# Altium schematic sheet FPGA_Bank_0_Supplies.SchDoc
size 420 x 297 mm; EDA_Number: ARTIQ; CompanyName: WUT ISE; Organization: WUT ISE; DocumentNumber: 12; SheetNumber: 7; ModifiedBy: -; Title2: FPGA power&caps + bank 0; ModifiedDate: -
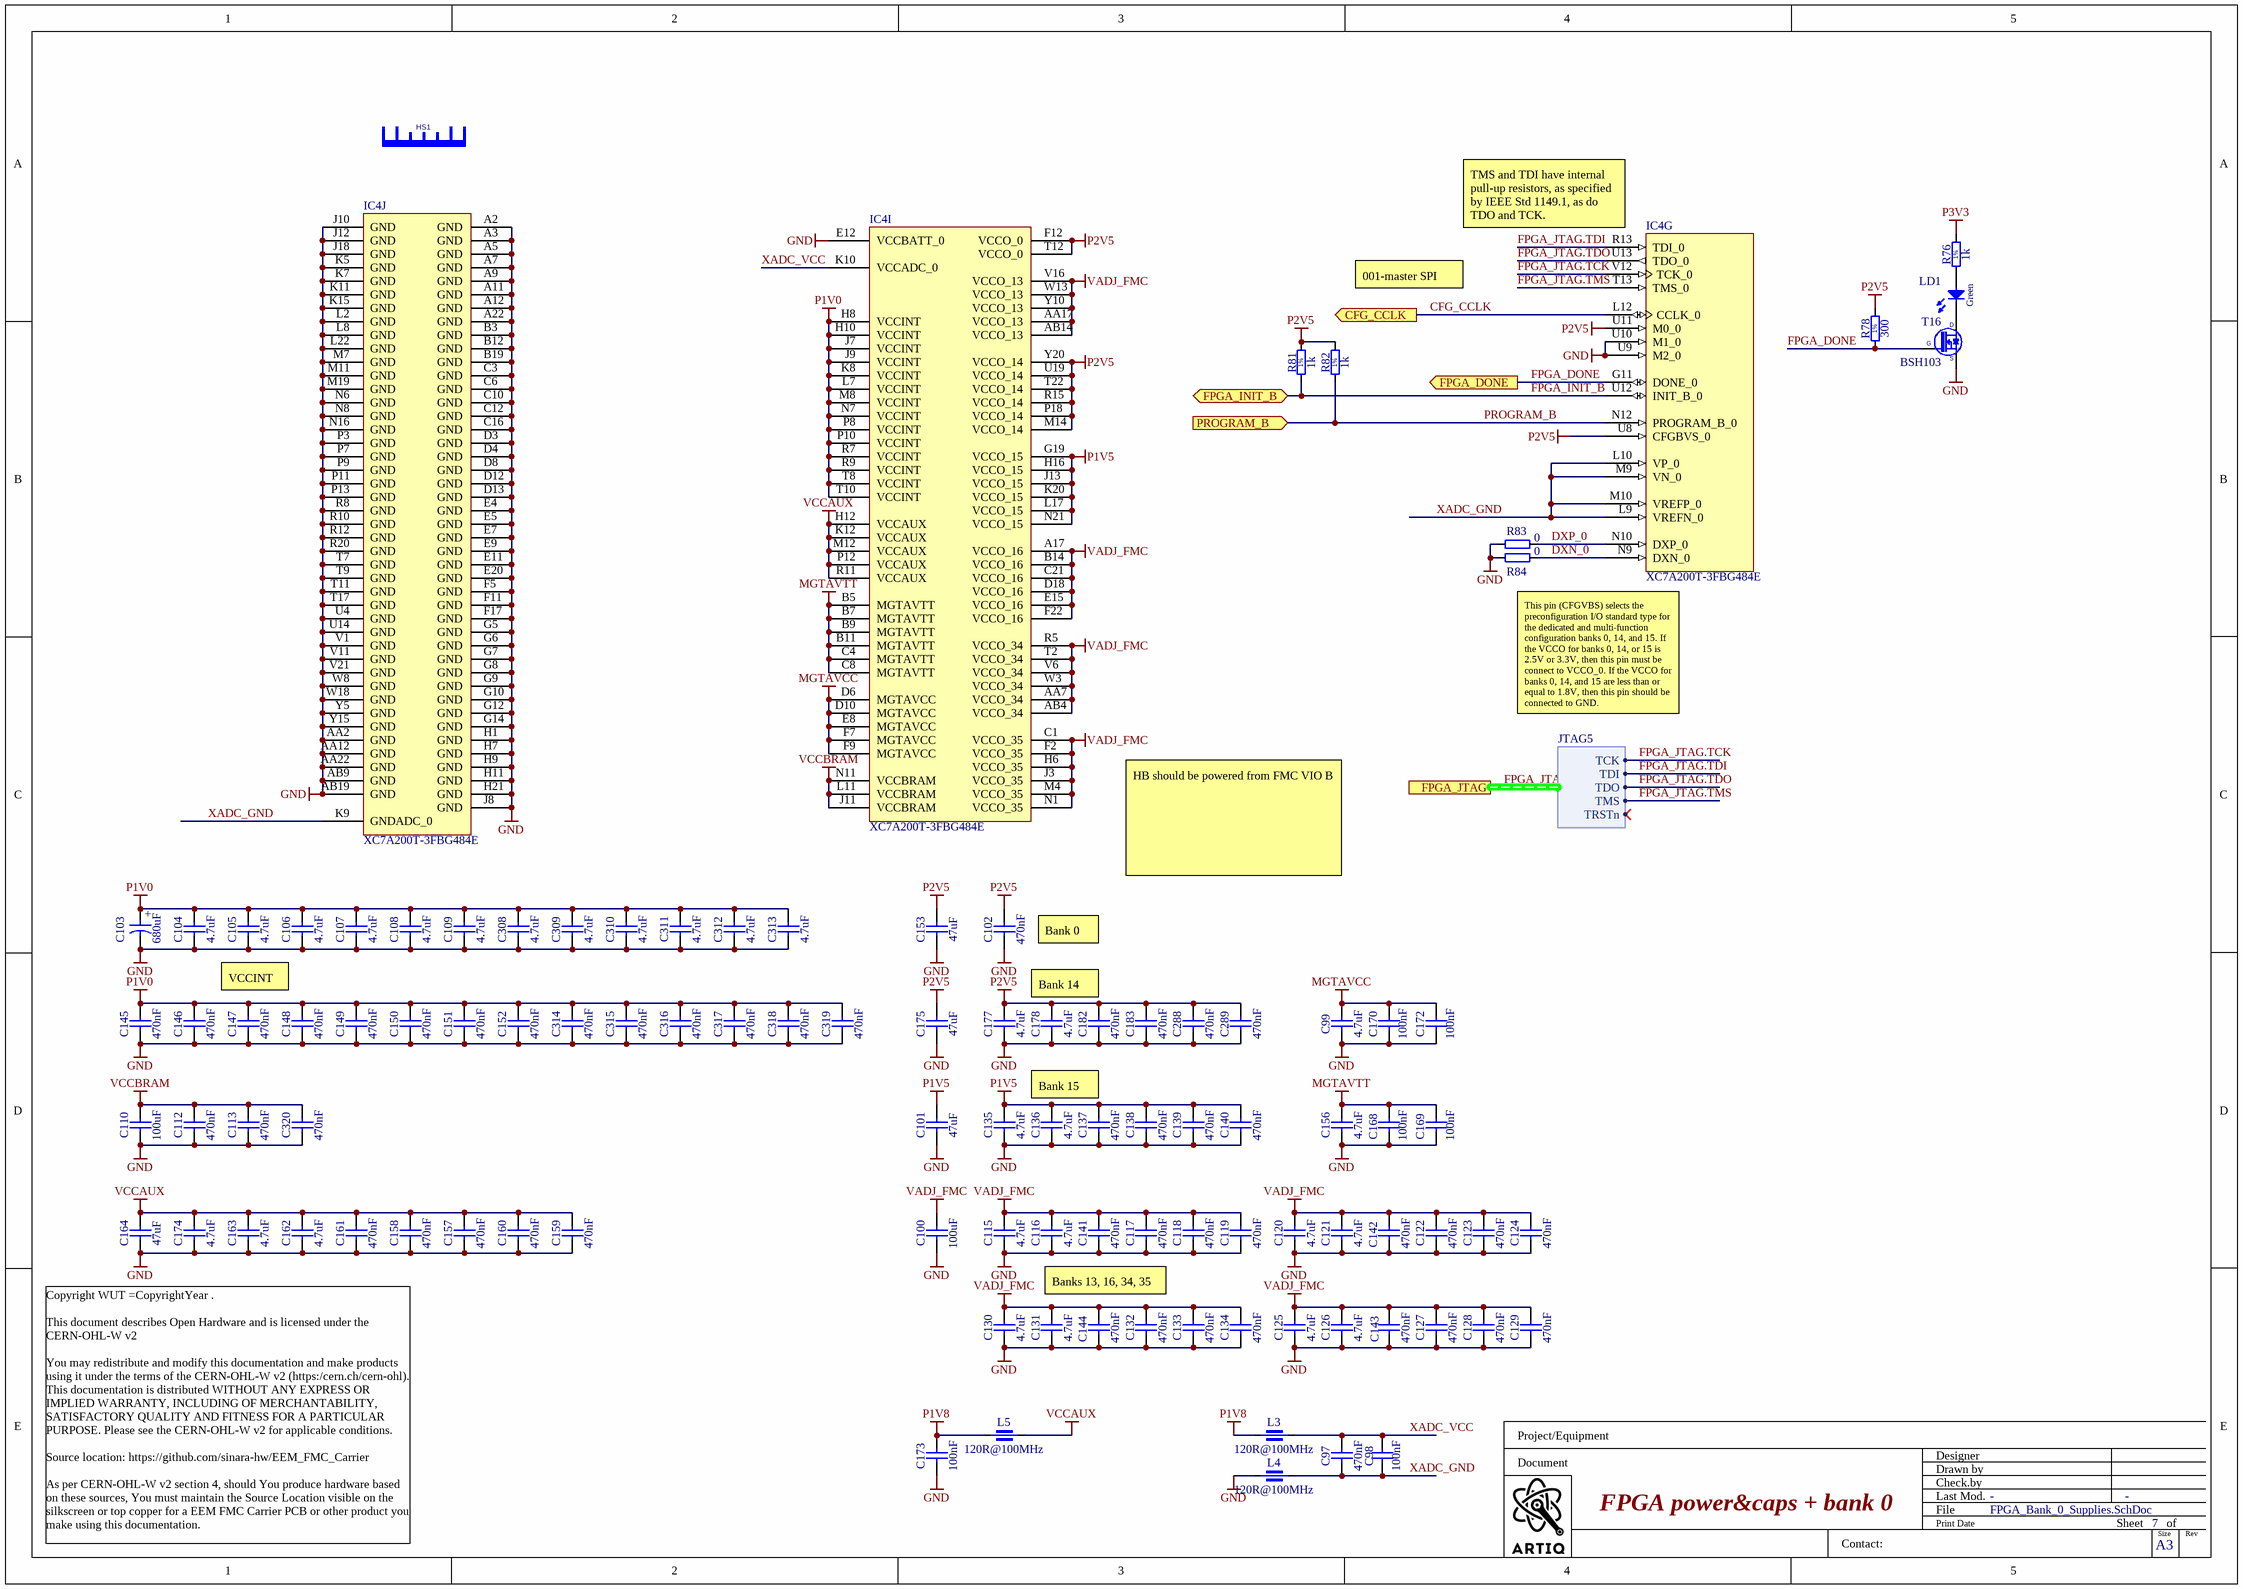
[diagram p0: FPGA_Bank_0_Supplies.SchDoc]

## Parts
C97  470nF  [CAPC0603X33N]
C98  100nF  [CAPC0603X33N]
C99  4.7uF  [CAPC1005X55N]
C100  100uF  [CAPC3216X180N]
C101  47uF  [CAPC1608X100N]
C102  470nF  [CAPC0603X33N]
C103  680uF  [CAPMP7343X430N]
C104  4.7uF  [CAPC1005X55N]
C105  4.7uF  [CAPC1005X55N]
C106  4.7uF  [CAPC1005X55N]
C107  4.7uF  [CAPC1005X55N]
C108  4.7uF  [CAPC1005X55N]
C109  4.7uF  [CAPC1005X55N]
C110  100uF  [CAPC3216X180N]
C112  470nF  [CAPC0603X33N]
C113  470nF  [CAPC0603X33N]
C115  4.7uF  [CAPC1005X55N]
C116  4.7uF  [CAPC1005X55N]
C117  470nF  [CAPC0603X33N]
C118  470nF  [CAPC0603X33N]
C119  470nF  [CAPC0603X33N]
C120  4.7uF  [CAPC1005X55N]
C121  4.7uF  [CAPC1005X55N]
C122  470nF  [CAPC0603X33N]
C123  470nF  [CAPC0603X33N]
C124  470nF  [CAPC0603X33N]
C125  4.7uF  [CAPC1005X55N]
C126  4.7uF  [CAPC1005X55N]
C127  470nF  [CAPC0603X33N]
C128  470nF  [CAPC0603X33N]
C129  470nF  [CAPC0603X33N]
C130  4.7uF  [CAPC1005X55N]
C131  4.7uF  [CAPC1005X55N]
C132  470nF  [CAPC0603X33N]
C133  470nF  [CAPC0603X33N]
C134  470nF  [CAPC0603X33N]
C135  4.7uF  [CAPC1005X55N]
C136  4.7uF  [CAPC1005X55N]
C137  470nF  [CAPC0603X33N]
C138  470nF  [CAPC0603X33N]
C139  470nF  [CAPC0603X33N]
C140  470nF  [CAPC0603X33N]
C141  470nF  [CAPC0603X33N]
C142  470nF  [CAPC0603X33N]
C143  470nF  [CAPC0603X33N]
C144  470nF  [CAPC0603X33N]
C145  470nF  [CAPC0603X33N]
C146  470nF  [CAPC0603X33N]
C147  470nF  [CAPC0603X33N]
C148  470nF  [CAPC0603X33N]
C149  470nF  [CAPC0603X33N]
C150  470nF  [CAPC0603X33N]
C151  470nF  [CAPC0603X33N]
C152  470nF  [CAPC0603X33N]
C153  47uF  [CAPC1608X100N]
C156  4.7uF  [CAPC1005X55N]
C157  470nF  [CAPC0603X33N]
C158  470nF  [CAPC0603X33N]
C159  470nF  [CAPC0603X33N]
C160  470nF  [CAPC0603X33N]
C161  470nF  [CAPC0603X33N]
C162  4.7uF  [CAPC1005X55N]
C163  4.7uF  [CAPC1005X55N]
C164  47uF  [CAPC1608X100N]
C168  100nF  [CAPC0603X33N]
C169  100nF  [CAPC0603X33N]
C170  100nF  [CAPC0603X33N]
C172  100nF  [CAPC0603X33N]
C173  100nF  [CAPC0603X33N]
C174  4.7uF  [CAPC1005X55N]
C175  47uF  [CAPC1608X100N]
C177  4.7uF  [CAPC1005X55N]
C178  4.7uF  [CAPC1005X55N]
C182  470nF  [CAPC0603X33N]
C183  470nF  [CAPC0603X33N]
C288  470nF  [CAPC0603X33N]
C289  470nF  [CAPC0603X33N]
C308  4.7uF  [CAPC1005X55N]
C309  4.7uF  [CAPC1005X55N]
C310  4.7uF  [CAPC1005X55N]
C311  4.7uF  [CAPC1005X55N]
C312  4.7uF  [CAPC1005X55N]
C313  4.7uF  [CAPC1005X55N]
C314  470nF  [CAPC0603X33N]
C315  470nF  [CAPC0603X33N]
C316  470nF  [CAPC0603X33N]
C317  470nF  [CAPC0603X33N]
C318  470nF  [CAPC0603X33N]
C319  470nF  [CAPC0603X33N]
C320  470nF  [CAPC0603X33N]
HS1  RADIAN_FI23  [RADIAN_FI23]  (value not drawn)
IC4  XC7A200T-3FBG484E  [BGA484C100P22X22_2300X2300X254]  (parts G,I,J of 10)
L3  120R@100MHz  [INDC1608X65N]
L4  120R@100MHz  [INDC1608X65N]
L5  120R@100MHz  [INDC1608X65N]
LD1  Green  [LED_KINGBRIGHT_KPH-1608CGCK]
R76  1k  [RESC1005X40N]
R78  300  [RESC1005X40N]
R81  1k  [RESC1005X40N]
R82  1k  [RESC1005X40N]
R83  0  [RESC0603X28N]
R84  0  [RESC0603X28N]
T16  BSH103  [SOT95P230X110-3N]

## Ports
CFG_CCLK (out), FPGA_DONE (out), FPGA_INIT_B (bidir), FPGA_JTAG (harness JTAG5), PROGRAM_B (in)

## Harnesses
JTAG5: TCK, TDI, TDO, TMS, TRSTn

## Nets
GND: C99.1 C100.1 C101.1 C102.1 C103.2 C104.1 C105.1 C106.1 C107.1 C108.1 C109.1 C110.1 C112.1 C113.1 C115.1 C116.1 C117.1 C118.1 C119.1 C120.1 C121.1 C122.1 C123.1 C124.1 C125.1 C126.1 C127.1 C128.1 C129.1 C130.1 C131.1 C132.1 C133.1 C134.1 C135.1 C136.1 C137.1 C138.1 C139.1 C140.1 C141.1 C142.1 C143.1 C144.1 C145.1 C146.1 C147.1 C148.1 C149.1 C150.1 C151.1 C152.1 C153.1 C156.1 C157.1 C158.1 C159.1 C160.1 C161.1 C162.1 C163.1 C164.1 C168.1 C169.1 C170.1 C172.1 C173.1 C174.1 C175.1 C177.1 C178.1 C182.1 C183.1 C288.1 C289.1 C308.1 C309.1 C310.1 C311.1 C312.1 C313.1 C314.1 C315.1 C316.1 C317.1 C318.1 C319.1 C320.1 IC4.A2(GND) IC4.A3(GND) IC4.A5(GND) IC4.A7(GND) IC4.A9(GND) IC4.A11(GND) IC4.A12(GND) IC4.A22(GND) IC4.AA2(GND) IC4.AA12(GND) IC4.AA22(GND) IC4.AB9(GND) IC4.AB19(GND) IC4.B3(GND) IC4.B12(GND) IC4.B19(GND) IC4.C3(GND) IC4.C6(GND) IC4.C10(GND) IC4.C12(GND) IC4.C16(GND) IC4.D3(GND) IC4.D4(GND) IC4.D8(GND) IC4.D12(GND) IC4.D13(GND) IC4.E4(GND) IC4.E5(GND) IC4.E7(GND) IC4.E9(GND) IC4.E11(GND) IC4.E12(VCCBATT_0) IC4.E20(GND) IC4.F5(GND) IC4.F11(GND) IC4.F17(GND) IC4.G5(GND) IC4.G6(GND) IC4.G7(GND) IC4.G8(GND) IC4.G9(GND) IC4.G10(GND) IC4.G12(GND) IC4.G14(GND) IC4.H1(GND) IC4.H7(GND) IC4.H9(GND) IC4.H11(GND) IC4.H21(GND) IC4.J8(GND) IC4.J10(GND) IC4.J12(GND) IC4.J18(GND) IC4.K5(GND) IC4.K7(GND) IC4.K11(GND) IC4.K15(GND) IC4.L2(GND) IC4.L8(GND) IC4.L22(GND) IC4.M7(GND) IC4.M11(GND) IC4.M19(GND) IC4.N6(GND) IC4.N8(GND) IC4.N16(GND) IC4.P3(GND) IC4.P7(GND) IC4.P9(GND) IC4.P11(GND) IC4.P13(GND) IC4.R8(GND) IC4.R10(GND) IC4.R12(GND) IC4.R20(GND) IC4.T7(GND) IC4.T9(GND) IC4.T11(GND) IC4.T17(GND) IC4.U4(GND) IC4.U9(M2_0) IC4.U10(M1_0) IC4.U14(GND) IC4.V1(GND) IC4.V11(GND) IC4.V21(GND) IC4.W8(GND) IC4.W18(GND) IC4.Y5(GND) IC4.Y15(GND) L4.1 R83.1 R84.1 T16.2(S)
MGTAVCC: C99.2 C170.2 C172.2 IC4.D6(MGTAVCC) IC4.D10(MGTAVCC) IC4.E8(MGTAVCC) IC4.F7(MGTAVCC) IC4.F9(MGTAVCC)
MGTAVTT: C156.2 C168.2 C169.2 IC4.B5(MGTAVTT) IC4.B7(MGTAVTT) IC4.B9(MGTAVTT) IC4.B11(MGTAVTT) IC4.C4(MGTAVTT) IC4.C8(MGTAVTT)
P1V0: C103.1 C104.2 C105.2 C106.2 C107.2 C108.2 C109.2 C145.2 C146.2 C147.2 C148.2 C149.2 C150.2 C151.2 C152.2 C308.2 C309.2 C310.2 C311.2 C312.2 C313.2 C314.2 C315.2 C316.2 C317.2 C318.2 C319.2 IC4.H8(VCCINT) IC4.H10(VCCINT) IC4.J7(VCCINT) IC4.J9(VCCINT) IC4.K8(VCCINT) IC4.L7(VCCINT) IC4.M8(VCCINT) IC4.N7(VCCINT) IC4.P8(VCCINT) IC4.P10(VCCINT) IC4.R7(VCCINT) IC4.R9(VCCINT) IC4.T8(VCCINT) IC4.T10(VCCINT)
P1V5: C101.2 C135.2 C136.2 C137.2 C138.2 C139.2 C140.2 IC4.G19(VCCO_15) IC4.H16(VCCO_15) IC4.J13(VCCO_15) IC4.K20(VCCO_15) IC4.L17(VCCO_15) IC4.N21(VCCO_15)
P1V8: C173.2 L3.1 L5.1
P2V5: C102.2 C153.2 C175.2 C177.2 C178.2 C182.2 C183.2 C288.2 C289.2 IC4.F12(VCCO_0) IC4.M14(VCCO_14) IC4.P18(VCCO_14) IC4.R15(VCCO_14) IC4.T12(VCCO_0) IC4.T22(VCCO_14) IC4.U8(CFGBVS_0) IC4.U11(M0_0) IC4.U19(VCCO_14) IC4.Y20(VCCO_14) R78.2 R81.2 R82.2
P3V3: R76.2
VADJ_FMC: C100.2 C115.2 C116.2 C117.2 C118.2 C119.2 C120.2 C121.2 C122.2 C123.2 C124.2 C125.2 C126.2 C127.2 C128.2 C129.2 C130.2 C131.2 C132.2 C133.2 C134.2 C141.2 C142.2 C143.2 C144.2 IC4.A17(VCCO_16) IC4.AA7(VCCO_34) IC4.AA17(VCCO_13) IC4.AB4(VCCO_34) IC4.AB14(VCCO_13) IC4.B14(VCCO_16) IC4.C1(VCCO_35) IC4.C21(VCCO_16) IC4.D18(VCCO_16) IC4.E15(VCCO_16) IC4.F2(VCCO_35) IC4.F22(VCCO_16) IC4.H6(VCCO_35) IC4.J3(VCCO_35) IC4.M4(VCCO_35) IC4.N1(VCCO_35) IC4.R5(VCCO_34) IC4.T2(VCCO_34) IC4.V6(VCCO_34) IC4.V16(VCCO_13) IC4.W3(VCCO_34) IC4.W13(VCCO_13) IC4.Y10(VCCO_13)
VCCAUX: C157.2 C158.2 C159.2 C160.2 C161.2 C162.2 C163.2 C164.2 C174.2 IC4.H12(VCCAUX) IC4.K12(VCCAUX) IC4.M12(VCCAUX) IC4.P12(VCCAUX) IC4.R11(VCCAUX) L5.2
VCCBRAM: C110.2 C112.2 C113.2 C320.2 IC4.J11(VCCBRAM) IC4.L11(VCCBRAM) IC4.N11(VCCBRAM)
CFG_CCLK: IC4.L12(CCLK_0) ; port CFG_CCLK
DXN_0: IC4.N9(DXN_0) R84.2
DXP_0: IC4.N10(DXP_0) R83.2
FPGA_DONE: IC4.G11(DONE_0) R78.1 T16.1(G) ; port FPGA_DONE
FPGA_INIT_B: IC4.U12(INIT_B_0) R81.1 ; port FPGA_INIT_B
FPGA_JTAG.TCK: IC4.V12(TCK_0) ; port FPGA_JTAG.TCK
FPGA_JTAG.TDI: IC4.R13(TDI_0) ; port FPGA_JTAG.TDI
FPGA_JTAG.TDO: IC4.U13(TDO_0) ; port FPGA_JTAG.TDO
FPGA_JTAG.TMS: IC4.T13(TMS_0) ; port FPGA_JTAG.TMS
PROGRAM_B: IC4.N12(PROGRAM_B_0) R82.1 ; port PROGRAM_B
XADC_GND: C97.1 C98.1 IC4.K9(GNDADC_0) IC4.L9(VREFN_0) IC4.L10(VP_0) IC4.M9(VN_0) IC4.M10(VREFP_0) L4.2
XADC_VCC: C97.2 C98.2 IC4.K10(VCCADC_0) L3.2
NetLD1_1: LD1.1(C) T16.3(D)
NetLD1_2: LD1.2(A) R76.1

## Buses and harness runs
harness FPGA_JTAG = port FPGA_JTAG

## Notes on the sheet
- (near IC4) TMS and TDI have internal pull-up resistors, as specified by IEEE Std 1149.1, as do TDO and TCK.
- 001-master SPI
- This pin (CFGVBS) selects the preconfiguration I/O standard type for the dedicated and multi-function configuration banks 0, 14, and 15. If the VCCO for banks 0, 14, or 15 is 2.5V or 3.3V, then this pin must be connect to VCCO_0. If the VCCO for banks 0, 14, and 15 are less than or equal to 1.8V, then this pin should be connected to GND.
- (near C102) Bank 0
- HB should be powered from FMC VIO B
- VCCINT
- Bank 14
- Bank 15
- Banks 13, 16, 34, 35
- Project/Equipment
- Document
- Designer
- Drawn by
- Check.by
- Copyright WUT =CopyrightYear .
  This document describes Open Hardware and is licensed under the CERN-OHL-W v2
  You may redistribute and modify this documentation and make products using it under the terms of the CERN-OHL-W v2 (https:/cern.ch/cern-ohl). This documentation is distributed WITHOUT ANY EXPRESS OR IMPLIED WARRANTY, INCLUDING OF MERCHANTABILITY, SATISFACTORY QUALITY AND FITNESS FOR A PARTICULAR PURPOSE. Please see the CERN-OHL-W v2 for applicable conditions.
  Source location: https://github.com/sinara-hw/EEM_FMC_Carrier
  As per CERN-OHL-W v2 section 4, should You produce hardware based on these sources, You must maintain the Source Location visible on the silkscreen or top copper for a EEM FMC Carrier PCB or other product you make using this documentation.
- Contact:
- File
- Last Mod.
- Print Date
- Sheet
- Size
- A3
- of
- Rev
- (in symbol CTE7343-43_680UF_6.3V_10%_LESR0018_AVX_TPM) +
- (in symbol R0402_1K_1%_0.0625W_100PPM) 1%
- (in symbol R0402_300R_1%_0.0625W_100PPM) 1%

## Library data of the parts
C97 C102 C112 C113 C117-C119 C122-C124 C127-C129 C132-C134 C137-C152 C157-C161 C182 C183 C288 C289 C314-C320 = CC0201_470NF_4V_20%_X5R: Non-polarised capacitor; Part Description: SMD Multilayer Chip Ceramic Capacitor; Manufacturer: GENERIC; Manufacturer1 Part Number: AMK063BJ474MP-F; Voltage: 4V; TC: X5R; Tolerance: ±20%; Part Number: CC0201_470NF_4V_20%_X5R; Component Kind: Standard; Component Type: Standard; Pin Count: 2; Value: 470nF; Status: Not Recommended; Manufacturer Part Number: CC0201_470NF_4V_20%_X5R; Case: 0201; Mounted: Yes; Socket: No; SMD: Yes; Sense: No; Manufacturer1 Example: TAIYO YUDEN; Manufacturer1 ComponentHeight: 0.33mm; HelpURL: \\cern.ch\dfs\Applications\Altium\Datasheets\CC0201_X5R_TAIYO-YUDEN_STANDARD-CLASS2.pdf; Author: CERN DEM JLC; CreateDate: 27.05.2010; LatestRevisionDate: 27.05.2010
  C113 C117 C122 C127 C132 C138 C148 C159 C183 C315 C320: ClassName: Artix
C98 C168-C170 C172 C173 = CC0201_100NF_6.3V_10%_X5R: Non-polarised capacitor; Part Description: SMD Multilayer Chip Ceramic Capacitor; Manufacturer: GENERIC; Manufacturer1 Part Number: 02016D104KAT2A; Voltage: 6.3V; TC: X5R; Tolerance: ±10%; Part Number: CC0201_100NF_6.3V_10%_X5R; Component Kind: Standard; Component Type: Standard; Pin Count: 2; Value: 100nF; Status: Not Recommended; Manufacturer Part Number: CC0201_100NF_6.3V_10%_X5R; Case: 0201; Mounted: Yes; Socket: No; SMD: Yes; Sense: No; Manufacturer1 Example: AVX; Manufacturer1 ComponentHeight: 0.33mm; HelpURL: \\cern.ch\dfs\Applications\Altium\Datasheets\CC0201_X5R_AVX.pdf; Author: CERN DEM JLC
  C98 C168-C170 C172: CreateDate: 2007-12-03; LatestRevisionDate: 2007-12-03; ClassName: Artix
  C173: CreateDate: 03.12.2007; LatestRevisionDate: 03.12.2007
C99 C156 C174 = CC0402_4.7UF_6.3V_20%_X5R: Non-polarised capacitor; Part Description: SMD Multilayer Chip Ceramic Capacitor; Manufacturer: GENERIC; Manufacturer1 Part Number: C1005X5R0J475M050BC; Voltage: 6.3V; TC: X5R; Tolerance: ±20%; Part Number: CC0402_4.7UF_6.3V_20%_X5R; Component Kind: Standard; Component Type: Standard; Pin Count: 2; Value: 4.7uF; Status: Preferred; Manufacturer Part Number: CC0402_4.7UF_6.3V_20%_X5R; Case: 0402; Mounted: Yes; Socket: No; SMD: Yes; Sense: No; Manufacturer1 Example: TDK; Manufacturer1 ComponentHeight: 0.65mm; HelpURL: \\cern.ch\dfs\Applications\Altium\Datasheets\CC0402_X5R_TDK_C.pdf; Author: CERN DEM JLC; CreateDate: 03.03.2015; LatestRevisionDate: 03.03.2015
C100 C110 = CC1206_100UF_6.3V_20%_X5R: Non-polarised capacitor; Part Description: SMD Multilayer Chip Ceramic Capacitor; Manufacturer: GENERIC; Manufacturer1 Part Number: C1206C107M9PACTU; Voltage: 6.3V; TC: X5R; Tolerance: ±10%; Part Number: CC1206_100UF_6.3V_20%_X5R; Component Kind: Standard; Component Type: Standard; Pin Count: 2; Value: 100uF; Status: None; Manufacturer Part Number: CC1206_100UF_6.3V_20%_X5R; Case: 1206; Mounted: Yes; Socket: No; SMD: Yes; Sense: No; Manufacturer1 Example: KEMET; Manufacturer1 ComponentHeight: 1.8mm; HelpURL: \\cern.ch\dfs\Applications\Altium\Datasheets\CC1206_X5R_KEMET.pdf; Author: CERN DEM JLC; CreateDate: 26.09.2012; LatestRevisionDate: 26.09.2012
C101 C153 C164 C175 = CC0603_47UF_6.3V_20%_X5R: Non-polarised capacitor; Part Description: SMD Multilayer Chip Ceramic Capacitor; Manufacturer: GENERIC; Manufacturer1 Part Number: GRM188R60J476ME15D; Voltage: 6.3V; TC: X5R; Tolerance: ±20%; Part Number: CC0603_47UF_6.3V_20%_X5R; Component Kind: Standard; Component Type: Standard; Pin Count: 2; Value: 47uF; Status: None; Manufacturer Part Number: CC0603_47UF_6.3V_20%_X5R; Case: 0603; Mounted: Yes; Socket: No; SMD: Yes; Sense: No; Manufacturer1 Example: MURATA; Manufacturer1 ComponentHeight: 1mm; HelpURL: \\cern.ch\dfs\Applications\Altium\Datasheets\CC0603_MURATA_GRM188R60J476ME15D.pdf; Author: CERN DEM JLC; CreateDate: 01.02.2018; LatestRevisionDate: 01.02.2018
C103 = CTE7343-43_680UF_6.3V_10%_LESR0018_AVX_TPM: Polarised capacitor; Part Description: Ultra Low ESR 0R018 Multianode Tantalum Chip Capacitor; Manufacturer: AVX; Manufacturer Part Number: TPME687K006R0018; Voltage: 6.3V; Tolerance: ±10%; Part Number: CTE7343-43_680UF_6.3V_10%_LESR0018_AVX_TPM; Component Kind: Standard; Component Type: Standard; Pin Count: 2; Value: 680uF; Status: None; Case: E; Mounted: Yes; Socket: No; SMD: Yes; Sense: No; ComponentHeight: 4.3mm; HelpURL: \\cern.ch\dfs\Applications\Altium\Datasheets\CTE_AVX_TPM.pdf; Author: CERN DEM JLC; CreateDate: 13.10.2011; LatestRevisionDate: 13.10.2011
C104-C109 C115 C116 C120 C121 C125 C126 C130 C131 C135 C136 C162 C163 C177 C178 C308-C313 = CC0402_4.7UF_6.3V_20%_X5R: Non-polarised capacitor; Manufacturer: GENERIC; Part Description: SMD Multilayer Chip Ceramic Capacitor; Manufacturer1 Part Number: C1005X5R0J475M050BC; Voltage: 6.3V; TC: X5R; Tolerance: ±20%; Part Number: CC0402_4.7UF_6.3V_20%_X5R; Component Kind: Standard; Component Type: Standard; Pin Count: 2; Value: 4.7uF; Status: Preferred; Manufacturer Part Number: CC0402_4.7UF_6.3V_20%_X5R; Case: 0402; Mounted: Yes; Socket: No; SMD: Yes; Sense: No; Manufacturer1 Example: TDK; Manufacturer1 ComponentHeight: 0.65mm; HelpURL: \\cern.ch\dfs\Applications\Altium\Datasheets\CC0402_X5R_TDK_C.pdf; Author: CERN DEM JLC; CreateDate: 03.03.2015; LatestRevisionDate: 03.03.2015
HS1 = RADIAN_FI23: Heat Sink Without Pad; Manufacturer: Radian Thermal Products, Inc.; Manufacturer Part Number: FI23+BU+T725; Part Description: 23 x 23 x 16 mm, clip on heatsink with fan for IC design BGA and others; ComponentHeight: 16 mm; HelpURL: https://www.radianheatsinks.com/product/fi23/
IC4 = XC7A200T-3FBG484E: Artix-7 FPGA, 285 User I/Os, 4 GTP, 484-Ball BGA, Pb-Free; Manufacturer Part Number: XC7A200T-3FBG484E; Device: XC7A200T-3FBG484E
L3-L5 = IND0603_MURATA_BLM18SG121TN1D: Part Description: SMD EMIFIL Suppression Chip Ferrite Bead; Manufacturer: MURATA; Power: 3A; Resistance: 0.025R; Tolerance: ±25%; Part Number: IND0603_MURATA_BLM18SG121TN1D; Component Kind: Standard; Component Type: Standard; Pin Count: 2; Value: 120R@100MHz; Status: None; Manufacturer Part Number: BLM18SG121TN1D; Case: 0603; Mounted: Yes; Socket: No; SMD: Yes; Sense: No; ComponentHeight: 0.65mm; HelpURL: \\cern.ch\dfs\Applications\Altium\Datasheets\IND0603_MURATA_BLM18S.pdf; Author: CERN DEM JLC; CreateDate: 23.07.2014; LatestRevisionDate: 25.10.2018
LD1 = LED_KINGBRIGHT_KPH-1608CGCK: LED Green 1C 2A; Part Description: SMD Green LED, Case 1.6mmX0.8mm(0603), 0.65mm Thickness; PressFit: No; Bonding: No; Manufacturer Part Number: KPH-1608CGCK; ComponentHeight: 0.65mm; HelpURL: \\cern.ch\dfs\Applications\Altium\Datasheets\LED_KINGBRIGHT_KPH-1608CGCK.pdf; Part Number: LED_KINGBRIGHT_KPH-1608CGCK; Component Kind: Standard; Component Type: Standard; Color: Green; PackageDescription: SMT Green LED, Case 0603, Body L 1.6 x W 0.8mm H 0.65mm; Manufacturer: KINGBRIGHT; Pin Count: 2; Mounted: Yes; Socket: No; SMD: Yes; Sense: No; Author: CERN DEM JLC; CreateDate: 03.07.2017; LatestRevisionDate: 03.07.2017
R76 R81 R82 = R0402_1K_1%_0.0625W_100PPM: Resistor - 1%; Part Description: General Purpose Thick Film Chip Resistor; Manufacturer: GENERIC; Manufacturer1 Part Number: 232270671002L; TC: ±100ppm/°C; PressFit: No; Part Number: R0402_1K_1%_0.0625W_100PPM; Component Kind: Standard; Component Type: Standard; Pin Count: 2; Value: 1k; Status: Not Recommended; Power: 0.0625W; Tolerance: ±1%; Manufacturer Part Number: R0402_1K_1%_0.0625W_100PPM; Case: 0402; Mounted: Yes; Sense: No; Socket: No; SMD: Yes; Manufacturer1 Example: YAGEO PHYCOMP; Manufacturer1 ComponentHeight: 0.4mm; HelpURL: \\cern.ch\dfs\Applications\Altium\Datasheets\R0402_Phycomp_RC0402.pdf; Author: CERN DEM JLC; CreateDate: 03.12.2007; LatestRevisionDate: 17.10.2012; ClassName: Artix
R78 = R0402_300R_1%_0.0625W_100PPM: Resistor - 1%; Part Description: General Purpose Thick Film Chip Resistor; Manufacturer: GENERIC; Manufacturer1 Part Number: 232270673001L; TC: ±100ppm/°C; PressFit: No; Part Number: R0402_300R_1%_0.0625W_100PPM; Component Kind: Standard; Component Type: Standard; Pin Count: 2; Value: 300; Status: Not Recommended; Power: 0.0625W; Tolerance: ±1%; Manufacturer Part Number: R0402_300R_1%_0.0625W_100PPM; Case: 0402; Mounted: Yes; Sense: No; Socket: No; SMD: Yes; Manufacturer1 Example: YAGEO PHYCOMP; Manufacturer1 ComponentHeight: 0.4mm; HelpURL: \\cern.ch\dfs\Applications\Altium\Datasheets\R0402_Phycomp_RC0402.pdf; Author: CERN DEM JLC; CreateDate: 03.12.2007; LatestRevisionDate: 17.10.2012
R83 R84 = R0201_0R_JUMPER: Resistor; Part Description: 1A (0.05R Max DC Resistance) Zero Ohm Jumper; Manufacturer: GENERIC; Manufacturer1 Part Number: CRCW02010000Z0ED; PressFit: No; Part Number: R0201_0R_JUMPER; Component Kind: Standard; Component Type: Standard; Pin Count: 2; Value: 0; Status: Not Recommended; Manufacturer Part Number: R0201_0R_JUMPER; Case: 0201; Mounted: Yes; Sense: No; Socket: No; SMD: Yes; Manufacturer1 Example: VISHAY; Manufacturer1 ComponentHeight: 0.27mm; HelpURL: \\cern.ch\dfs\Applications\Altium\Datasheets\R0201_VISHAY_CRCW e3.pdf; Author: CERN DEM JLC; CreateDate: 19.11.2014; LatestRevisionDate: 08.01.2015
T16 = BSH103: N-CHANNEL MOSFET WITH DIODE; Part Description: 30V 850mA N-Channel Enhancement Mode Field-Effect Transistor; Manufacturer: NEXPERIA; PressFit: No; Bonding: No; Part Number: BSH103; Component Kind: Standard; Component Type: Standard; Device: BSH103; PackageDescription: SOT23, 0.95mm Pitch; 3 Pin, 1.30mm W X 2.90mm L X 1.10mm H body, IPC Medium Density; Manufacturer Part Number: BSH103; Pin Count: 3; Case: SOT23-3; Mounted: Yes; Socket: No; SMD: Yes; Sense: No; ComponentHeight: 1.1mm; HelpURL: \\cern.ch\dfs\Applications\Altium\Datasheets\BSH103.pdf; Author: CERN DEM JLC; CreateDate: 16.03.2010; LatestRevisionDate: 20.06.2017